# Altium schematic sheet FOC主控M.SchDoc
size A4
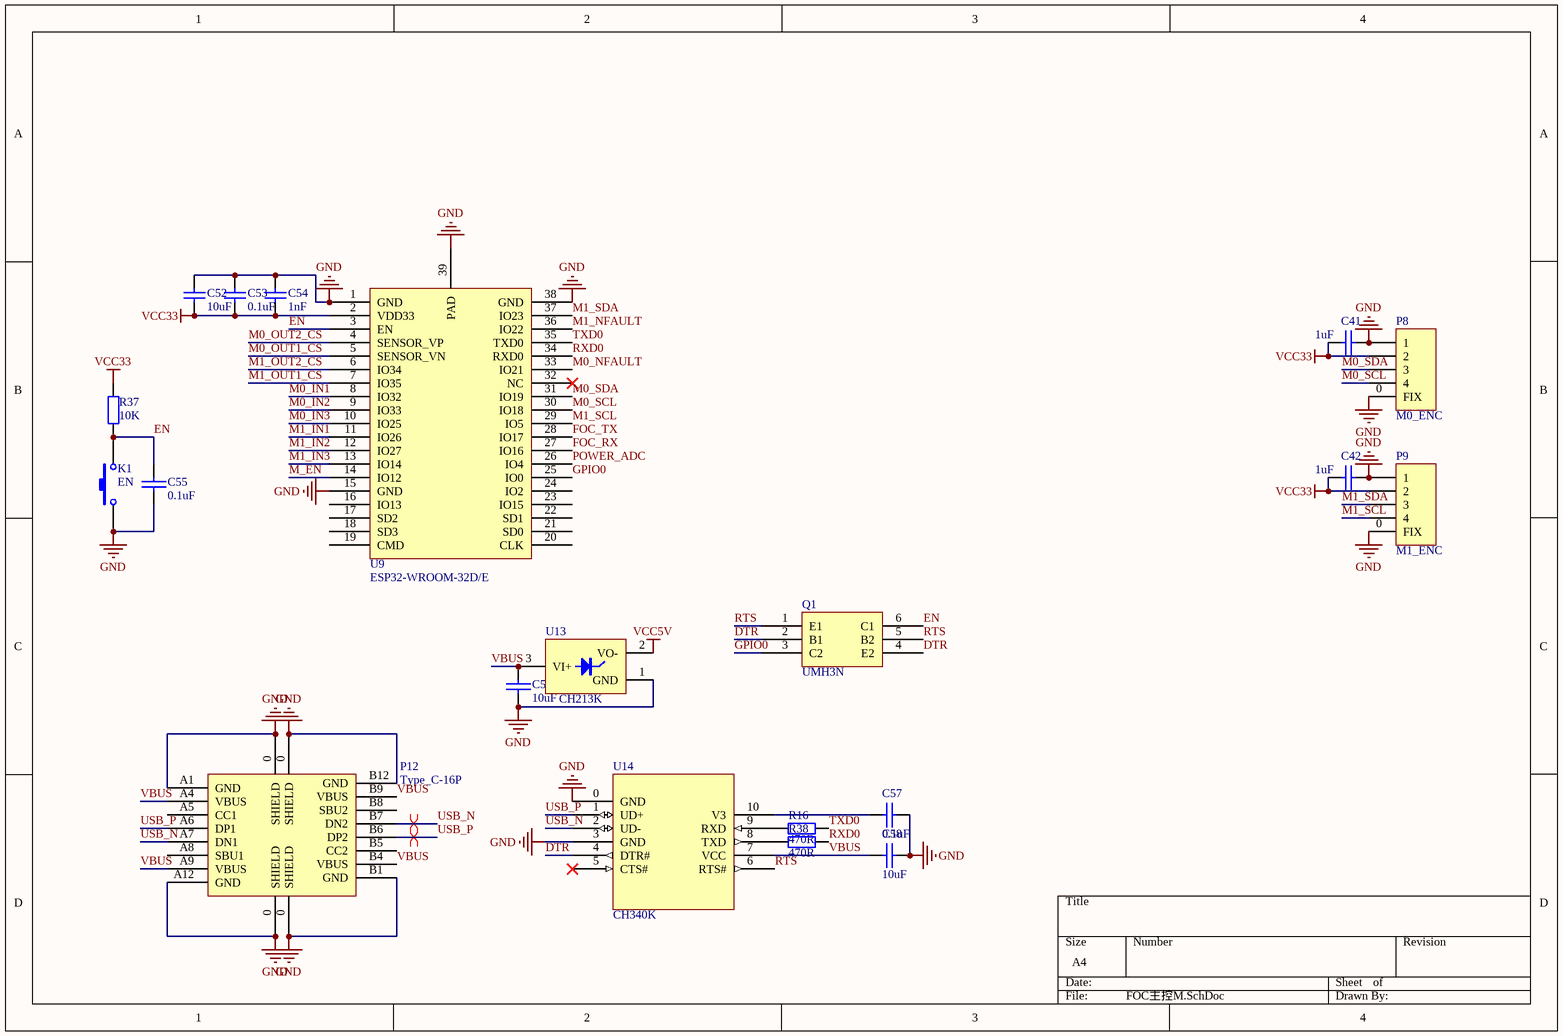
[diagram p0: FOC主控M.SchDoc]

## Parts
C41  1uF  [C0805_M]
C42  1uF  [C0805_M]
C52  10uF  [C0805_M]
C53  0.1uF  [C0805_M]
C54  1nF  [C0805_M]
C55  0.1uF  [C0805_M]
C56  10uF  [C0805_M]
C57  0.1uF  [C0805_M]
C58  10uF  [C0805_M]
K1  EN  [SW_SMT]
P8  M0_ENC  [SH1.0-WT-4P]
P9  M1_ENC  [SH1.0-WT-4P]
P12  Type_C-16P  [USB-C-SMD_16P]
Q1  UMH3N  [SOT363_M]
R16  470R  [R0805_M]
R37  10K  [R0805_M]
R38  470R  [R0805_M]
U9  ESP32-WROOM-32D/E  [ESP32-WROOM-32D/E]
U13  CH213K  [SOT-23-3]
U14  CH340K  [ESSOP10]

## Nets
GND: C41.2 C42.2 C52.2 C53.2 C54.2 C55.1 C56.1 C57.1 C58.1 K1.1 P8.0(FIX) P8.1 P9.0(FIX) P9.1 P12.0(SHIELD) P12.A1(GND) P12.A12(GND) P12.B1(GND) P12.B12(GND) U9.1(GND) U9.15(GND) U9.38(GND) U9.39(PAD) U13.1(GND) U14.0(GND) U14.3(GND)
VCC5V: U13.2(VO-)
VCC33: C41.1 C42.1 C52.1 C53.1 C54.1 P8.2 P9.2 R37.1 U9.2(VDD33)
DTR: Q1.2(B1) Q1.4(E2) U14.4(DTR#)
EN: C55.2 K1.2 Q1.6(C1) R37.2 U9.3(EN)
FOC_RX: U9.27(IO16)
FOC_TX: U9.28(IO17)
GPIO0: Q1.3(C2) U9.25(IO0)
M0_IN1: U9.8(IO32)
M0_IN2: U9.9(IO33)
M0_IN3: U9.10(IO25)
M0_NFAULT: U9.33(IO21)
M0_OUT1_CS: U9.5(SENSOR_VN)
M0_OUT2_CS: U9.4(SENSOR_VP)
M0_SCL: P8.4 U9.30(IO18)
M0_SDA: P8.3 U9.31(IO19)
M1_IN1: U9.11(IO26)
M1_IN2: U9.12(IO27)
M1_IN3: U9.13(IO14)
M1_NFAULT: U9.36(IO22)
M1_OUT1_CS: U9.7(IO35)
M1_OUT2_CS: U9.6(IO34)
M1_SCL: P9.4 U9.29(IO5)
M1_SDA: P9.3 U9.37(IO23)
M_EN: U9.14(IO12)
POWER_ADC: U9.26(IO4)
RTS: Q1.1(E1) Q1.5(B2) U14.6(RTS#)
RXD0: R38.2 U9.34(RXD0)
TXD0: R16.2 U9.35(TXD0)
USB_N: P12.A7(DN1) P12.B7(DN2) U14.2(UD-)
USB_P: P12.A6(DP1) P12.B6(DP2) U14.1(UD+)
VBUS: C56.2 C58.2 P12.A4(VBUS) P12.A9(VBUS) P12.B4(VBUS) P12.B9(VBUS) U13.3(VI+) U14.7(VCC)
NetC57_2: C57.2 U14.10(V3)
NetR16_1: R16.1 U14.9(RXD)
NetR38_1: R38.1 U14.8(TXD)

Not connected (* = marked no-connect by the designer): P12 A5(CC1) A8(SBU1) B5(CC2) B8(SBU2); U9 16(IO13) 17(SD2) 18(SD3) 19(CMD) 20(CLK) 21(SD0) 22(SD1) 23(IO15) 24(IO2) 32(NC)*; U14 5(CTS#)*

## Layout directives
differential pair: USB_N, USB_P

## Library data of the parts
C41 C42 C55-C58 = CAP: Capacitor
C52-C54 = Cap: Capacitor; Value: 100pF; Published: 8-Jun-2000; LatestRevisionDate: 17-Jul-2002; LatestRevisionNote: Re-released for DXP Platform.; PackageReference: RAD-0.3; Publisher: Altium Limited; PackageDescription: Radial Cap, Thru-Hole; 2 Leads; 0.3 in Pin Spacing
K1 = SW-PB: Switch; Published: 24-Mar-1999; LatestRevisionDate: 17-Jul-2002; LatestRevisionNote: Re-released for DXP Platform.; PackageReference: SPST-2; Publisher: Altium Limited; PackageDescription: Switch; 2 Leads
P8 P9 = Header 5: LatestRevisionDate: 17-Jul-2002; LatestRevisionNote: Re-released for DXP Platform.; Publisher: Altium Limited
Q1 = D2NPN: 数字晶体管（带电阻）
R16 R37 R38 = Res2: Resistor; Value: 1K; Published: 8-Jun-2000; LatestRevisionDate: 17-Jul-2002; LatestRevisionNote: Re-released for DXP Platform.; PackageReference: AXIAL-0.4; Publisher: Altium Limited; PackageDescription: Axial Device, Thru-Hole; 2 Leads; 0.4 in Pin Spacing
U13 = CH213K: Ideal Diode 5V*1A
U14 = CH340K: USB to TTL Serial / UART for dual power